# Altium project forwardConverterPCB.PrjPcb (part 10 of 22)
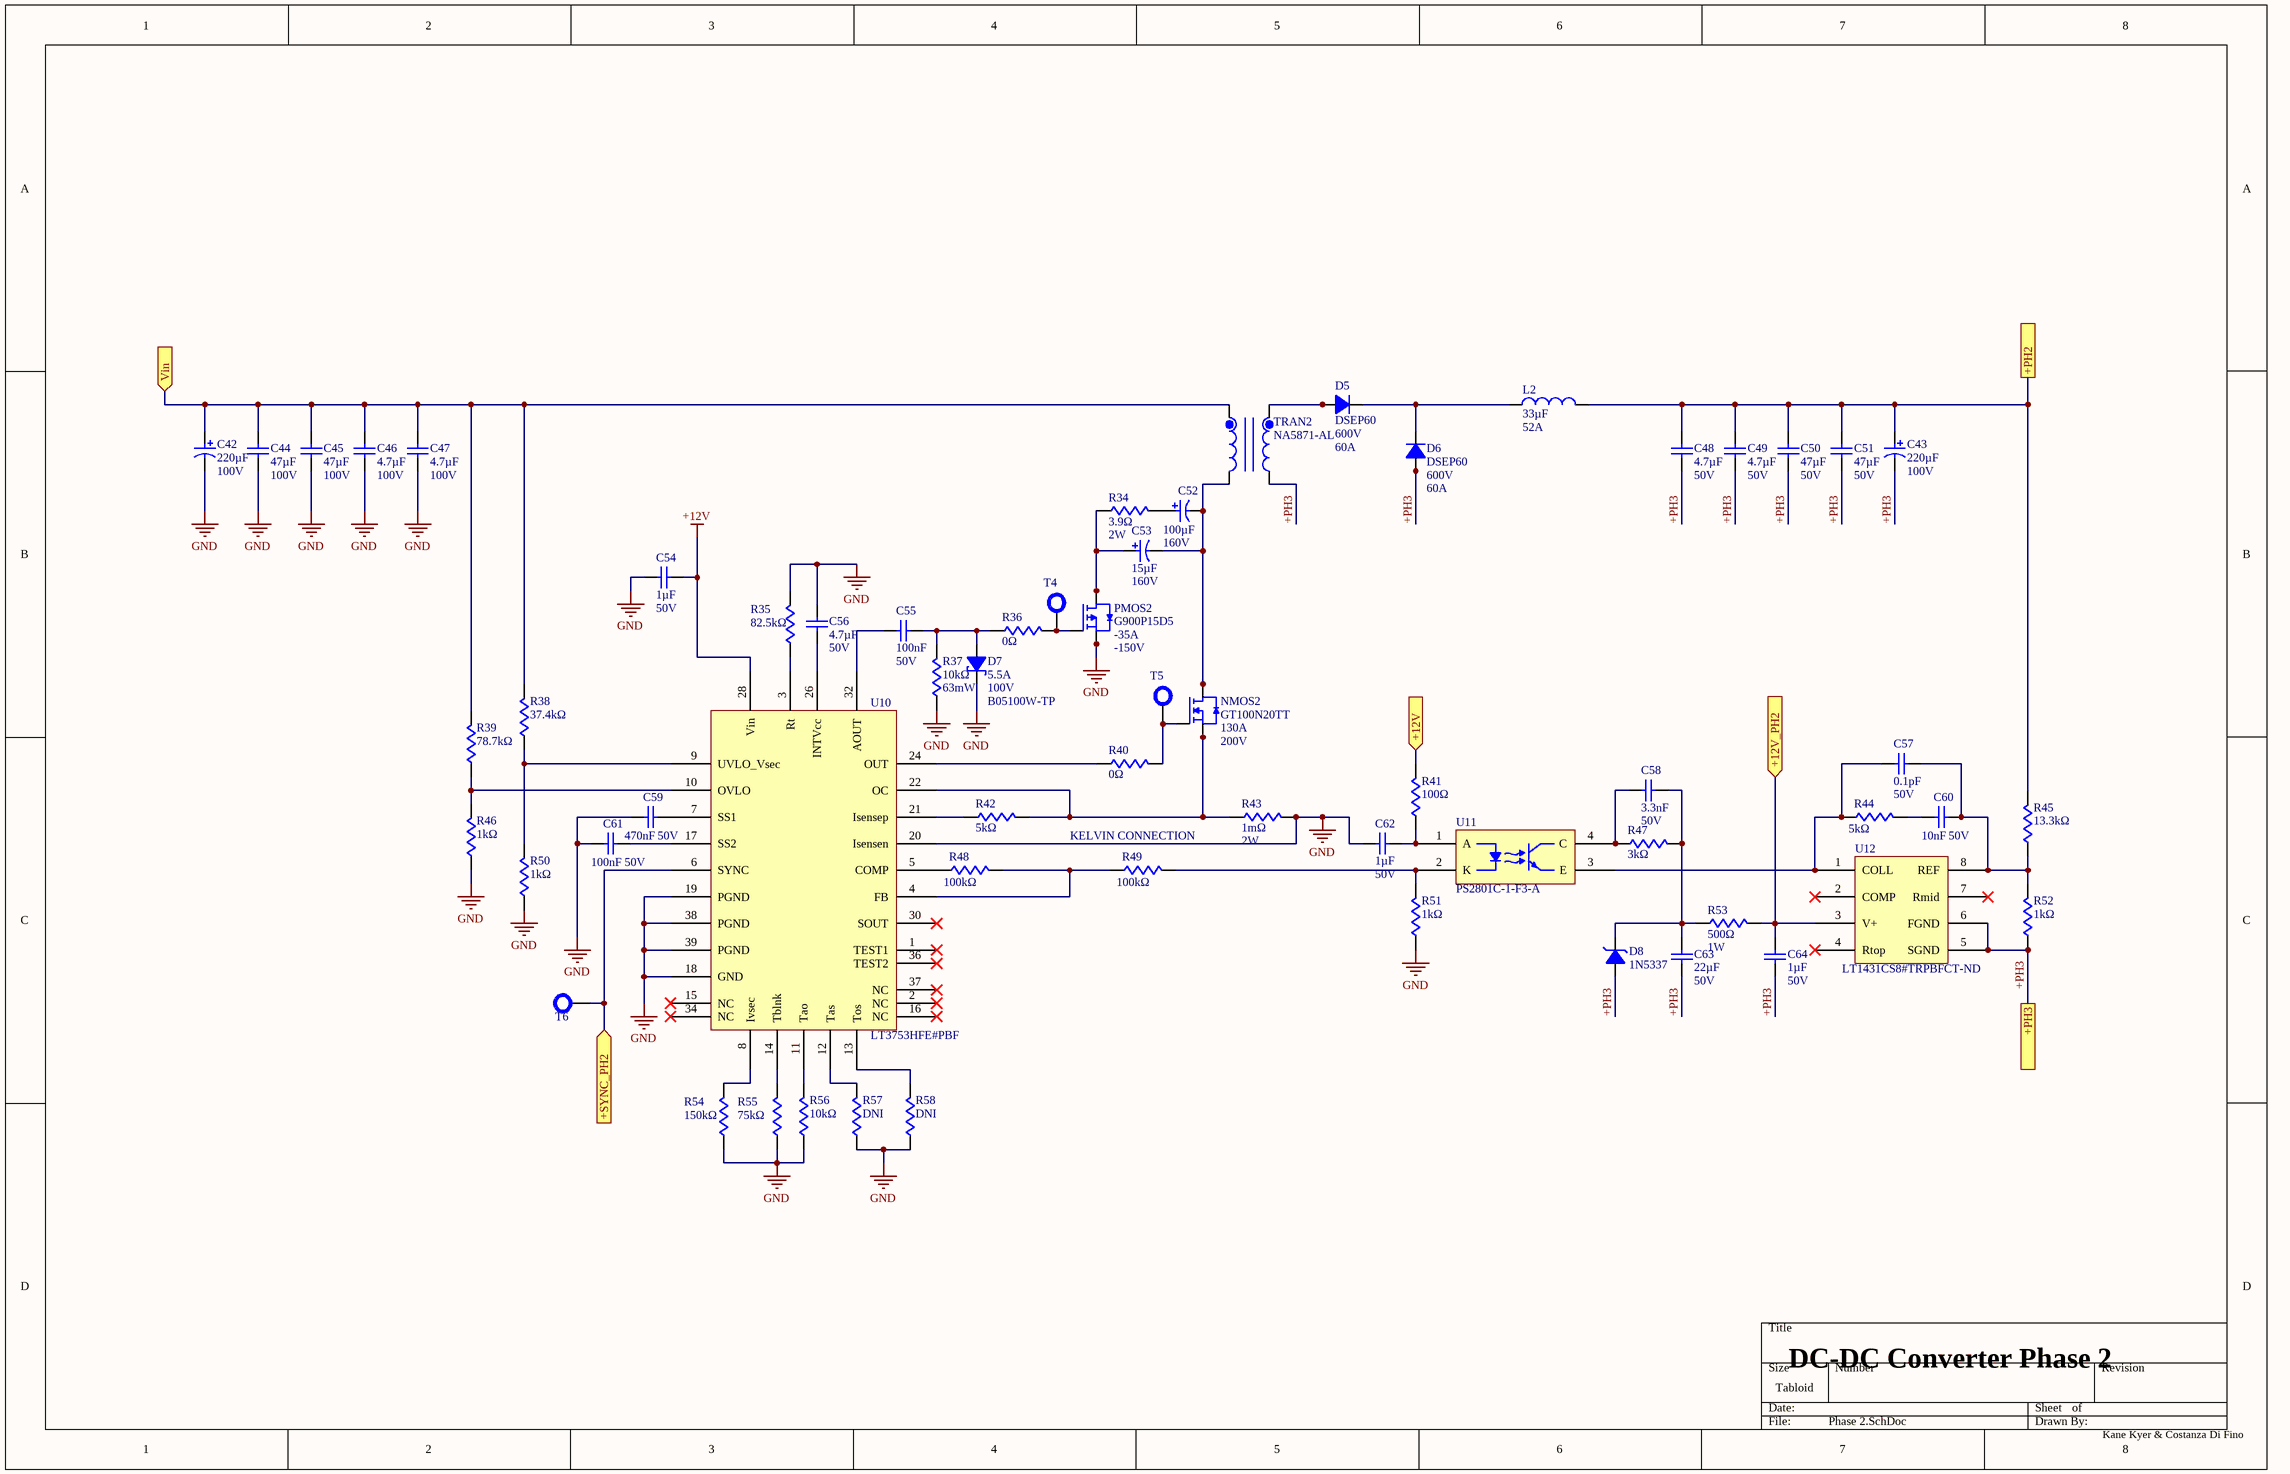
[diagram p15: Phase 2.SchDoc]

## Sheet Phase 2.SchDoc (continued)

### Library data of the parts (continued)
U11 = PS2801C-1-F3-A: Optocoupler DC-IN 1-CH Transistor DC-OUT 4-Pin SSOP T/R; Manufacturer: Renesas; Manufacturer Lifecycle Status: ACTIVE; Collector Emitter Breakdown Voltage: 80V; Collector Emitter Saturation Voltage: 300mV; Current Transfer Ratio: 50%; Dark Current: 100nA; Forward Current: 30mA; Forward Voltage: 1.4V; Input Current: 5mA; Isolation Voltage: 2.5kV; Max Power Dissipation: 120mW; Number of Elements: 1; Reverse Breakdown Voltage: 6V; Target Application: PLC\, Hybrid IC\, Power supply\, OA\, Measuring instrument\, Modem\, Communication devices; Supplier: DigiKey; RoHS: Compliant; Category: Optocouplers; Stock: 8089; Pricing: 1=0.85, 10=0.594, 100=0.436, 500=0.3653, 1000=0.34213 (USD); Case/Package: SSOP; China RoHS: Compliant; Collector Emitter Voltage (VCEO): 80V; Contact Plating: Tin Bismuth; Export Control Classification Number (ECCN) Code: EAR99; Part Family: PS2801C-1; Height: 2.1mm; Harmonized Tariff Schedule (HTS) Code: 8541.49.8000; Lifecycle Status: Production; Max Operating Temperature: 100°C; Min Operating Temperature: -55°C; MSL: 1; Mounting Technology: Surface Mount; Pins: 4; Output Voltage: 80V; Packaging: Cut Tape; REACH SVHC: Yes; ComponentLink1URL: https://datasheet.octopart.com:443/PS2801C-1-F3-A-Renesas-datasheet-179197394.pdf?src-supplier=Integrated+Device+Technology; ComponentLink1Description: https://datasheet.octopart.com:443/PS2801C-1-F3-A-Renesas-datasheet-179197394.pdf?src-supplier=Integrated+Device+Technology; ComponentLink2URL: https://datasheet.octopart.com:443/PS2801C-1-F3-A-Renesas-datasheet-150850810.pdf?src-supplier=Integrated+Device+Technology; ComponentLink2Description: https://datasheet.octopart.com:443/PS2801C-1-F3-A-Renesas-datasheet-150850810.pdf?src-supplier=Integrated+Device+Technology; ComponentLink3URL: https://datasheet.octopart.com:443/PS2801C-1-F3-A-Integrated-Device-Technology-datasheet-149188203.pdf?src-supplier=Integrated+Device+Technology; ComponentLink3Description: https://datasheet.octopart.com:443/PS2801C-1-F3-A-Integrated-Device-Technology-datasheet-149188203.pdf?src-supplier=Integrated+Device+Technology; ComponentLink4URL: https://datasheet.octopart.com:443/PS2801C-1-F3-A-Renesas-datasheet-181196928.pdf?src-supplier=IHS; ComponentLink4Description: https://datasheet.octopart.com:443/PS2801C-1-F3-A-Renesas-datasheet-181196928.pdf?src-supplier=IHS; ComponentLink5URL: https://datasheet.octopart.com:443/PS2801C-1-F3-A-NEC-datasheet-180895691.pdf?src-supplier=IHS; ComponentLink5Description: https://datasheet.octopart.com:443/PS2801C-1-F3-A-NEC-datasheet-180895691.pdf?src-supplier=IHS; ComponentLink6URL: https://datasheet.octopart.com:443/PS2801C-1-F3-A-Renesas-datasheet-138175760.pdf?src-supplier=Renesas; ComponentLink6Description: https://datasheet.octopart.com:443/PS2801C-1-F3-A-Renesas-datasheet-138175760.pdf?src-supplier=Renesas; ComponentLink7URL: https://datasheet.octopart.com:443/PS2801C-1-F3-A-Renesas-datasheet-5346041.pdf?src-supplier=element14+APAC; ComponentLink7Description: https://datasheet.octopart.com:443/PS2801C-1-F3-A-Renesas-datasheet-5346041.pdf?src-supplier=element14+APAC; ComponentLink8URL: https://datasheet.octopart.com:443/PS2801C-1-F3-A-Renesas-datasheet-136880012.pdf?src-supplier=Future+Electronics; ComponentLink8Description: https://datasheet.octopart.com:443/PS2801C-1-F3-A-Renesas-datasheet-136880012.pdf?src-supplier=Future+Electronics; ComponentLink9URL: http://sigma.octopart.com:80/reach_statement/Renesas-company-45.pdf?src-supplier=Compliance+Statements; ComponentLink9Description: http://sigma.octopart.com:80/reach_statement/Renesas-company-45.pdf?src-supplier=Compliance+Statements; ComponentLink10URL: http://sigma.octopart.com:80/conflict_mineral_statement/Renesas-company-44.pdf?src-supplier=Compliance+Statements; ComponentLink10Description: http://sigma.octopart.com:80/conflict_mineral_statement/Renesas-company-44.pdf?src-supplier=Compliance+Statements; Supplier Part Number: 559-1038-1-ND; Manufacturer Part Number: PS2801C-1-F3-A
U12 = LT1431CS8#TRPBF: V-Ref Adjustable 2.5V to 36V 100mA 8-Pin SOIC N T/R; Manufacturer: Analog Devices; Manufacturer Lifecycle Status: PRODUCTION; Cathode Current: 1mA; Reference Type: Shunt; Temperature Coefficient: 30ppm/°C; Tolerance: 0.4%; Supplier: DigiKey; Manufacturer Part Number: LT1431CS8#TRPBF; RoHS: Compliant; Category: Voltage References; Stock: 6692; Pricing: 1=4.76, 10=3.623, 25=3.3384, 100=3.025, 250=2.9682 (USD); Lead Free: Lead Free; Lifecycle Status: Production; Max Operating Temperature: 70°C; Max Output Voltage: 36V; Min Operating Temperature: 0°C; Min Output Voltage: 2.5V; Mounting Technology: Surface Mount; Pins: 8; Output Current: 100mA; Output Type: Adjustable; ComponentLink1URL: https://octopart.com:443/opatz8j6/c1?t=niELlFxzDfi0yCwovPYUCPkFv5h4fu5j3fc6Y_JWgZS-KG3gguwV1nhos1IG-X0q8FOT95_5suT6z4bIqEEHZa5Cr0Tl4wX-4Gea3le2l_P5Btni36aNB0VKN1eACfVw6XjlixpjNPZ2EoCnIZsmdjVtLb4T5dOKJqdmaG9p1s8rLUbRPnop80aw4yYD8dobzP2rtKjoPZxkMFX7s_x1MbrDISVlTufhy0OqU5fodmlGcRlmdB2uK6Q8wi9wAMnylkp3u30aJUXp9y1pTV4VT8brQ8AQsJucKiRghXvlz7QI_mNVRP68og&src-supplier=Analog+Devices; ComponentLink1Description: https://octopart.com:443/opatz8j6/c1?t=niELlFxzDfi0yCwovPYUCPkFv5h4fu5j3fc6Y_JWgZS-KG3gguwV1nhos1IG-X0q8FOT95_5suT6z4bIqEEHZa5Cr0Tl4wX-4Gea3le2l_P5Btni36aNB0VKN1eACfVw6XjlixpjNPZ2EoCnIZsmdjVtLb4T5dOKJqdmaG9p1s8rLUbRPnop80aw4yYD8dobzP2rtKjoPZxkMFX7s_x1MbrDISVlTufhy0OqU5fodmlGcRlmdB2uK6Q8wi9wAMnylkp3u30aJUXp9y1pTV4VT8brQ8AQsJucKiRghXvlz7QI_mNVRP68og&src-supplier=Analog+Devices; ComponentLink2URL: https://datasheet.octopart.com:443/LT1431CS8%23TRPBF-Analog-Devices-datasheet-158590489.pdf?src-supplier=Augswan; ComponentLink2Description: https://datasheet.octopart.com:443/LT1431CS8%23TRPBF-Analog-Devices-datasheet-158590489.pdf?src-supplier=Augswan; ComponentLink3URL: https://sigma.octopart.com:443/57689574/technical_drawing/Linear-Technology-LT1431CS8%23TRPBF.pdf?src-supplier=Linear+Technology; ComponentLink3Description: https://sigma.octopart.com:443/57689574/technical_drawing/Linear-Technology-LT1431CS8%23TRPBF.pdf?src-supplier=Linear+Technology; ComponentLink4URL: https://datasheet.octopart.com:443/LT1431CS8%23TRPBF-Linear-Technology-datasheet-12663249.pdf?src-supplier=Linear+Technology; ComponentLink4Description: https://datasheet.octopart.com:443/LT1431CS8%23TRPBF-Linear-Technology-datasheet-12663249.pdf?src-supplier=Linear+Technology; ComponentLink5URL: https://datasheet.octopart.com:443/LT1431CS8%23TRPBF-Linear-Technology-datasheet-14162000.pdf?src-supplier=iiiC; ComponentLink5Description: https://datasheet.octopart.com:443/LT1431CS8%23TRPBF-Linear-Technology-datasheet-14162000.pdf?src-supplier=iiiC; ComponentLink6URL: https://datasheet.octopart.com:443/LT1431CS8%23TRPBF-Linear-Technology-datasheet-660441.pdf?src-supplier=Component+Distributors+Inc.; ComponentLink6Description: https://datasheet.octopart.com:443/LT1431CS8%23TRPBF-Linear-Technology-datasheet-660441.pdf?src-supplier=Component+Distributors+Inc.; ComponentLink7URL: http://sigma.octopart.com:80/conflict_mineral_statement/Analog-Devices-company-33.pdf?src-supplier=Compliance+Statements; ComponentLink7Description: http://sigma.octopart.com:80/conflict_mineral_statement/Analog-Devices-company-33.pdf?src-supplier=Compliance+Statements; ComponentLink8URL: https://octopart.com:443/opatz8j6/c1?t=x_UgC8z0ZW9HVBYfWtRK1MQXyidqPpcSjAfueHo9YnawvAkFl5SvDyGxYSqo2jvWZKzVJDVTRvwyt6-9bSOmk9hm3rvBRrSJoViBsOBz-zaTqDQ1UuTon1oynDbAG1BJ8LFFGJ-pvHqqe_ahwIPaiUAyxwKDpl_WDXhLfkPwU4s3DC4oM42DqSA56VDCGnGZU0YdFavN5d4mf8bZyX9JjAzy5--p3JbOg0D6jqXi6c2GCo47z_BbYPuyEPlhjEKZPTviFMXkQtwuopNuNXSm1BD9XLOQFCoZDF8jjiZ5eNS4L1NzzTsuyw&src-supplier=Compliance+Statements; ComponentLink8Description: https://octopart.com:443/opatz8j6/c1?t=x_UgC8z0ZW9HVBYfWtRK1MQXyidqPpcSjAfueHo9YnawvAkFl5SvDyGxYSqo2jvWZKzVJDVTRvwyt6-9bSOmk9hm3rvBRrSJoViBsOBz-zaTqDQ1UuTon1oynDbAG1BJ8LFFGJ-pvHqqe_ahwIPaiUAyxwKDpl_WDXhLfkPwU4s3DC4oM42DqSA56VDCGnGZU0YdFavN5d4mf8bZyX9JjAzy5--p3JbOg0D6jqXi6c2GCo47z_BbYPuyEPlhjEKZPTviFMXkQtwuopNuNXSm1BD9XLOQFCoZDF8jjiZ5eNS4L1NzzTsuyw&src-supplier=Compliance+Statements

## Sheet Phase 3.SchDoc
size Tabloid; SheetNumber: 5; SheetTotal: 7
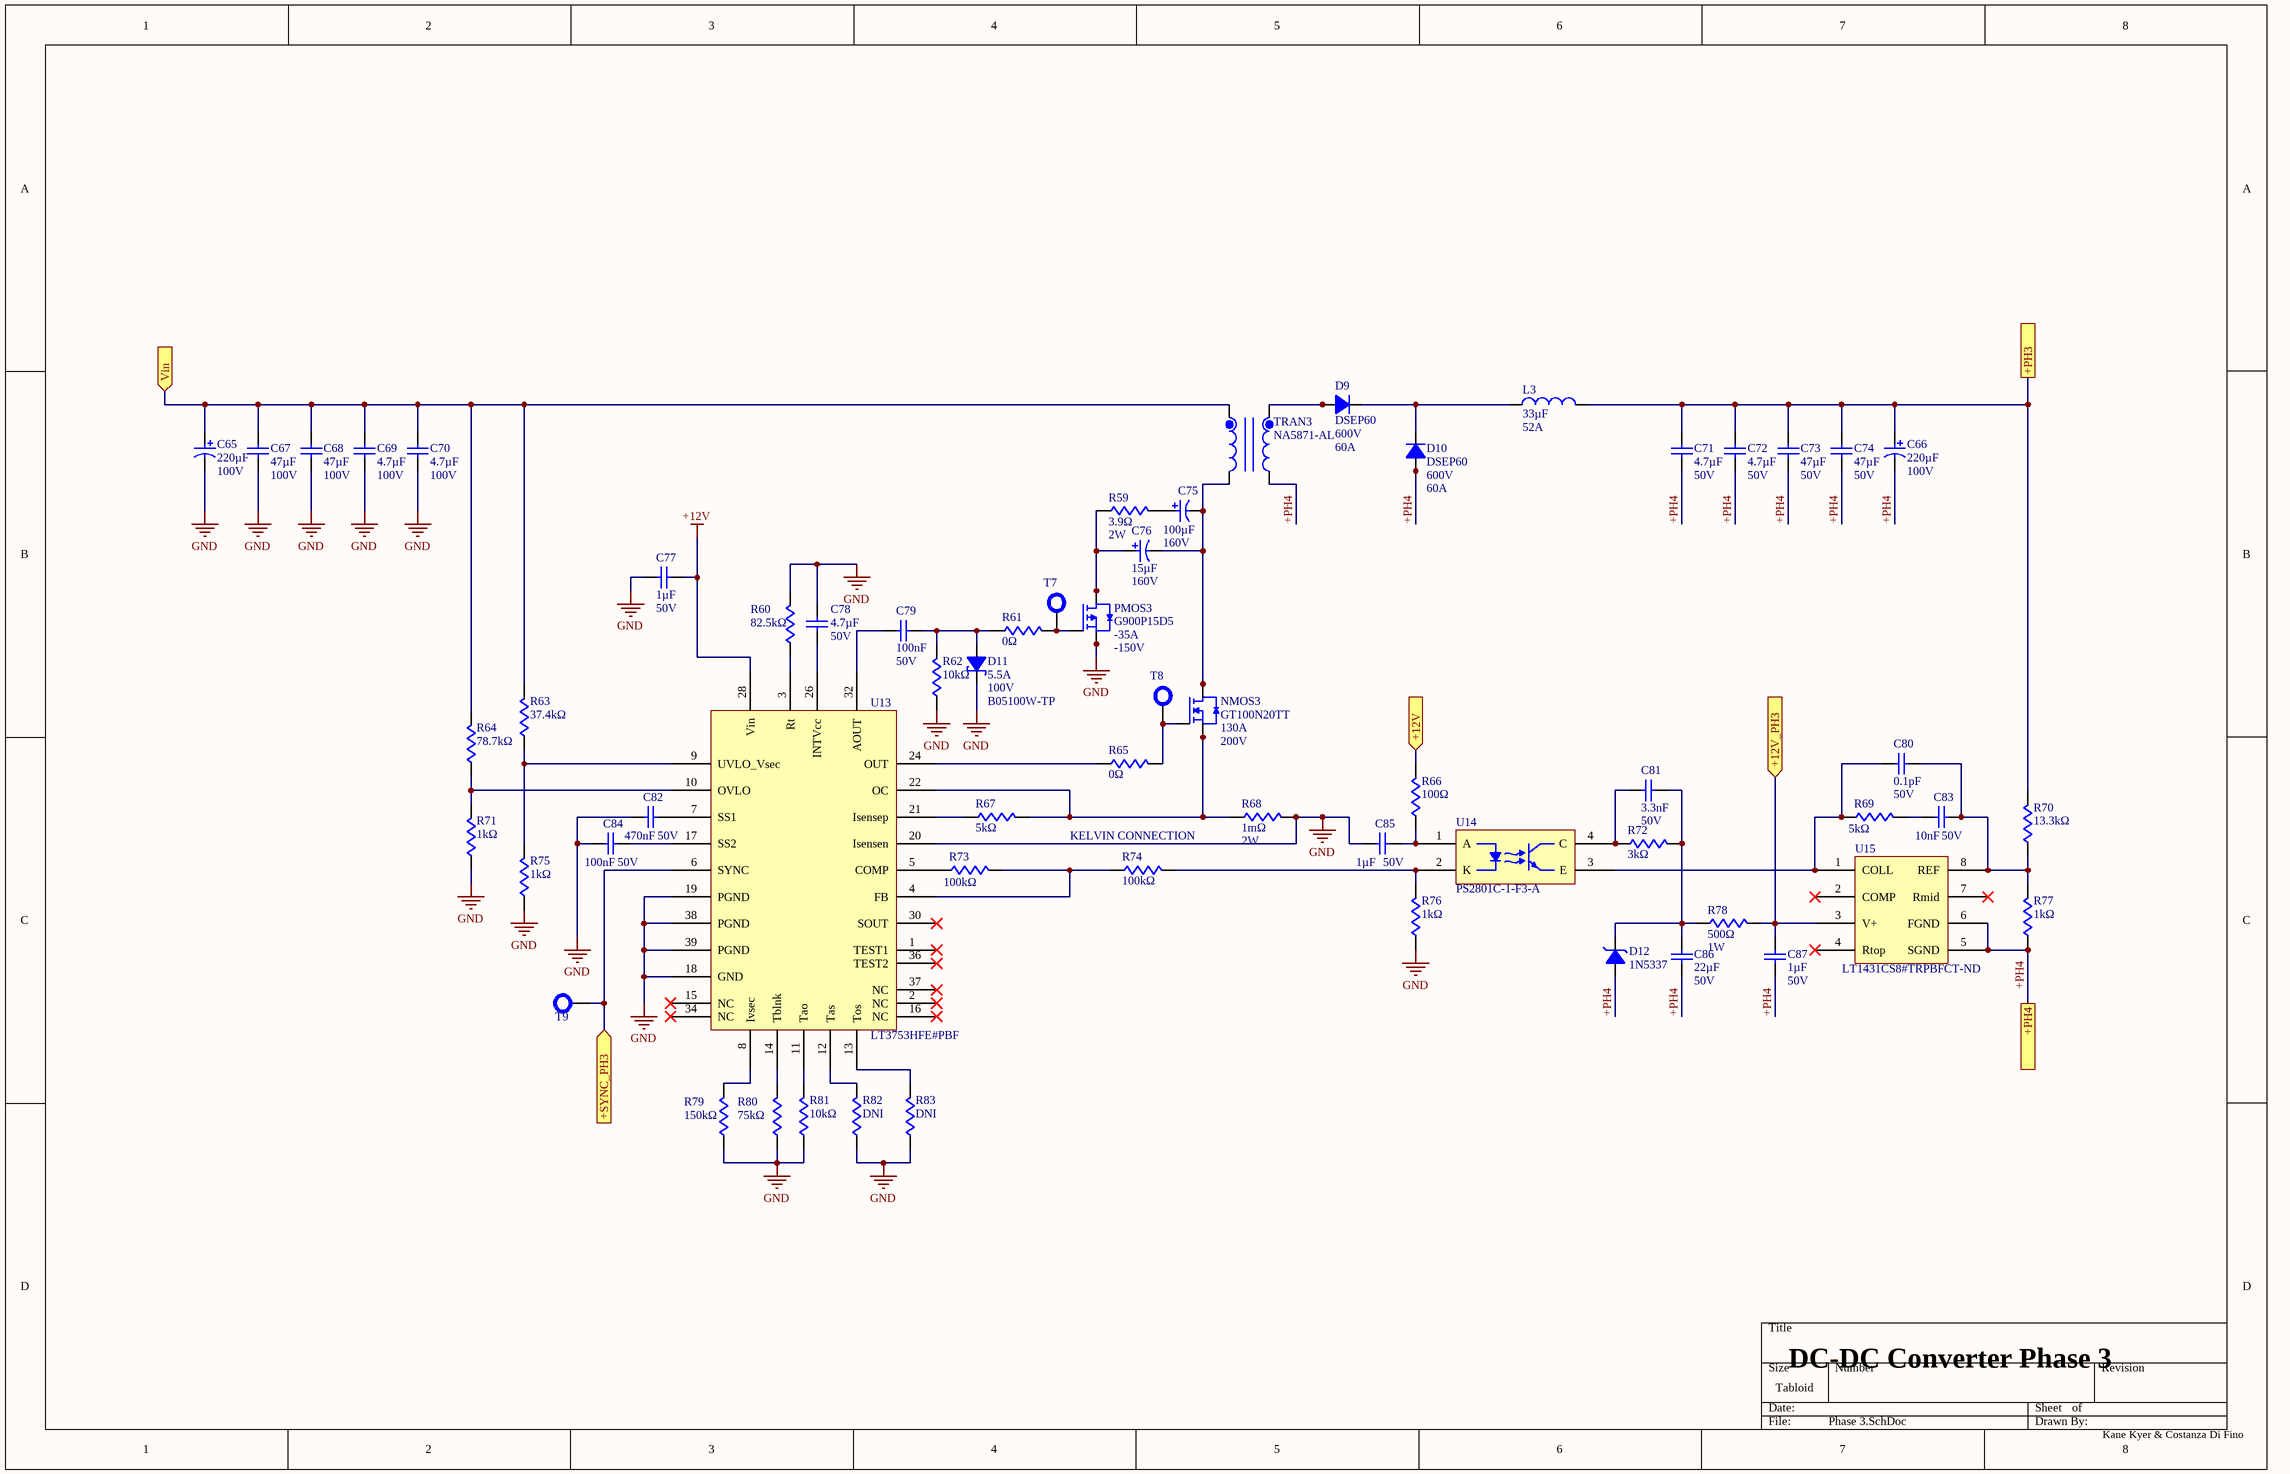
[diagram p4: Phase 3.SchDoc]

### Parts
C65  value 220µF  Voltage Rating: 100V  [C_AEC]  (hidden comment: AFK227M2AR44T-F)
C66  value 220µF  Voltage Rating: 100V  [C_AEC]  (hidden comment: AFK227M2AR44T-F)
C67  value 47µF  Voltage Rating: 100V  [C_CAA573]  (hidden comment: CAA573X7S2A476M640LH)
C68  value 47µF  Voltage Rating: 100V  [C_CAA573]  (hidden comment: CAA573X7S2A476M640LH)
C69  value 4.7µF  Voltage Rating (DC): 100V  [C_1210]  (hidden comment: GMC32X7S475K100NT)
C70  value 4.7µF  Voltage Rating (DC): 100V  [C_1210]  (hidden comment: GMC32X7S475K100NT)
C71  value 4.7µF  Voltage Rating (DC): 50V  [C_1206]  (hidden comment: GMC31X7R475K50NT)
C72  value 4.7µF  Voltage Rating (DC): 50V  [C_1206]  (hidden comment: GMC31X7R475K50NT)
C73  value 47µF  Voltage Rating (DC): 50V  [C_CKG57N]  (hidden comment: CKG57NX7R1H476M500JJ)
C74  value 47µF  Voltage Rating (DC): 50V  [C_CKG57N]  (hidden comment: CKG57NX7R1H476M500JJ)
C75  value 100µF  Voltage Rating (DC): 160V  [UUJ2C101MNJ1MS]  (hidden comment: UUJ2C101MNJ1MS)
C76  value 15µF  Voltage: 160V  [ULT2C150MNL1GS]  (hidden comment: ULT2C150MNL1GS)
C77  value 1µF  Voltage: 50V  [C_0805]  (hidden comment: CL21B105KBFNNNE)
C78  value 4.7µF  Voltage Rating (DC): 50V  [C_1206]  (hidden comment: GMC31X7R475K50NT)
C79  value 100nF  Voltage Rating: 50V  [C_0603]  (hidden comment: C0603C104K5RACTU)
C80  value 0.1pF  Voltage Rating: 50V  [C_0402]  (hidden comment: GJM1555C1HR10WB01D)
C81  value 3.3nF  Voltage Rating: 50V  [C_0603]  (hidden comment: GCM1885C1H332FA16D)
C82  value 470nF  Voltage Rating: 50V  [C_0402]  (hidden comment: GRM155R61H474KE11D)
C83  value 10nF  Voltage Rating: 50V  [C_0603]  (hidden comment: C0603C103K5RACTU)
C84  value 100nF  Voltage Rating: 50V  [C_0603]  (hidden comment: C0603C104K5RACTU)
C85  value 1µF  Voltage: 50V  [C_0805]  (hidden comment: CL21B105KBFNNNE)
C86  value 22µF  Voltage Rating (DC): 50V  [C_2220]  (hidden comment: GMC55X7R226M50NT)
C87  value 1µF  Voltage: 50V  [C_0805]  (hidden comment: CL21B105KBFNNNE)
D9  DSEP60  Vr: 600V  Io: 60A  [D_DSEP60]
D10  DSEP60  Vr: 600V  Io: 60A  [D_DSEP60]
D11  Max Forward Surge Current (Ifsm): 5.5A  Min Breakdown Voltage: 100V  [D_B05100W]  (hidden comment: B05100W-TP)
D12  Supplier Part Number: 1N5337  [D_1N5337]  (hidden comment: 1N5337BRLG)
L3  value 33µF  Irms: 52A  [CPEX4141L-330MC]  (hidden comment: CPEX4141L-330MC)
NMOS3  Id: 130A  Vds: 200V  [GT100N20TT]  (hidden comment: GT100N20TT)
PMOS3  Id: -35A  Vds: -150V  [G900P15]  (hidden comment: G900P15D5)
R59  value 3.9Ω  Power Rating: 2W  [R_SM2W]  (hidden comment: SMW23R9JT)
R60  value 82.5kΩ  [R_0805]  (hidden comment: RMCF0805FT82K5)
R61  value 0Ω  [R_0805]  (hidden comment: CRCW08050000Z0EA)
R62  value 10kΩ  [R_0402]  (hidden comment: RM04F1002CT)
R63  value 37.4kΩ  [R_0603]  (hidden comment: RC0603FR-0737K4L)
R64  value 78.7kΩ  [R_0603]  (hidden comment: RC0603FR-0778K7L)
R65  value 0Ω  [R_0805]  (hidden comment: CRCW08050000Z0EA)
R66  value 100Ω  [R_0603]  (hidden comment: RC0603FR-07100RL)
R67  value 5kΩ  [R_0402]  (hidden comment: PNM0402E5001BST1)
R68  value 1mΩ  Power Rating: 2W  [R_2512]  (hidden comment: CRE2512-FZ-R001E-2)
R69  value 5kΩ  [R_0402]  (hidden comment: PNM0402E5001BST1)
R70  value 13.3kΩ  [R_0603]  (hidden comment: RMCF0603FT13K3)
R71  value 1kΩ  [R_0402]  (hidden comment: RM04F1001CT)
R72  value 3kΩ  [C_0402]  (hidden comment: AC0402FR-073KL)
R73  value 100kΩ  [R_0402]  (hidden comment: RM04F1003CT)
R74  value 100kΩ  [R_0402]  (hidden comment: RM04F1003CT)
R75  value 1kΩ  [R_0402]  (hidden comment: RM04F1001CT)
R76  value 1kΩ  [R_0402]  (hidden comment: RM04F1001CT)
R77  value 1kΩ  [R_0402]  (hidden comment: RM04F1001CT)
R78  value 500Ω  Power Rating: 1W  [R_WSC2515]  (hidden comment: WSC2515500R0FEB)
R79  value 150kΩ  [R_0603]  (hidden comment: RC0603FR-07150KL)
R80  value 75kΩ  [R_0603]  (hidden comment: AC0603FR-0775KL)
R81  value 10kΩ  [R_0402]  (hidden comment: RM04F1002CT)
R82  value DNI  [R_0805]  (hidden comment: CRCW08050000Z0EA)
R83  value DNI  [R_0805]  (hidden comment: CRCW08050000Z0EA)
T7  TEST  [TEST_POINT]  (value not drawn)
T8  TEST  [TEST_POINT]  (value not drawn)
T9  TEST  [TEST_POINT]  (value not drawn)
TRAN3  NA5871-AL  [NA5871-AL]
U13  LT3753HFE#PBF  [LT3753]
U14  PS2801C-1-F3-A  [PS2801C]
U15  Supplier Part Number: LT1431CS8#TRPBFCT-ND  [LT1431]  (hidden comment: LT1431CS8#TRPBF)

### Ports
+12V (in, see SHEET_MAP[4C], Externals[2A], Phase 1[4C], Phase 2[4C], Phase 4[4C], Phase 5[4B]), +12V_PH3 (in, see SHEET_MAP[4C], Externals[6B]), +PH3 (see SHEET_MAP[4B], Externals[4C], Phase 2[6C]), +PH4 (see SHEET_MAP[4C], Externals[6B], Phase 4[6B]), +SYNC_PH3 (in, see SHEET_MAP[4C], Externals[3C]), Vin (in, see SHEET_MAP[4B], Externals[1A], Phase 1[1B], Phase 2[1B], Phase 4[1B], Phase 5[1B])

### Nets
+12V: C77.2 R66.2 U13.28(Vin) ; port +12V
GND: C65.2 C67.1 C68.1 C69.1 C70.1 C77.1 C78.1 C82.1 C84.1 C85.1 D11.1 PMOS3.1(S) PMOS3.2(S) PMOS3.3(S) R60.2 R62.1 R68.2 R71.1 R75.1 R76.1 R79.1 R80.1 R81.1 R82.1 R83.1 U13.18(GND) U13.19(PGND) U13.20(Isensen) U13.38(PGND) U13.39(PGND)
Vin: C65.1 C67.2 C68.2 C69.2 C70.2 R63.2 R64.2 TRAN3.1 ; port Vin
+PH3: C66.1 C71.2 C72.2 C73.2 C74.2 L3.2 R70.2 ; port +PH3
+PH4: C66.2 C71.1 C72.1 C73.1 C74.1 C86.1 C87.1 D10.1(A) D10.3(A) D12.2 R77.1 TRAN3.11 U15.5(SGND) U15.6(FGND) ; port +PH4
NetC27_2: C87.2 R78.2 U15.3(V+) ; port +12V_PH3
NetC75_1: C75.1 R59.2
NetC75_2: C75.2 C76.2 NMOS3.9(D) NMOS3.10(D) NMOS3.11(D) NMOS3.12(D) NMOS3.13(D) NMOS3.14(D) NMOS3.15(D) NMOS3.16(D) TRAN3.4
NetC76_1: C76.1 PMOS3.5(D) PMOS3.6(D) PMOS3.7(D) PMOS3.8(D) R59.1
NetC78_2: C78.2 U13.26(INTVcc)
NetC79_1: C79.1 U13.32(AOUT)
NetC79_2: C79.2 D11.2 R61.1 R62.2
NetC80_1: C80.1 R69.1 U14.3(E) U15.1(COLL)
NetC80_2: C80.2 C83.2 R70.1 R77.2 U15.8(REF)
NetC81_1: C81.1 R72.1 U14.4(C)
NetC81_2: C81.2 C86.2 D12.1 R72.2 R78.1
NetC82_2: C82.2 U13.7(SS1)
NetC83_1: C83.1 R69.2
NetC84_2: C84.2 U13.17(SS2)
NetC85_2: C85.2 R66.1 U14.1(A)
NetD9_1: D9.1(A) D9.3(A) TRAN3.6
NetD9_4: D9.4(C) D10.4(C) L3.1
NetNMOS3_1: NMOS3.1(S) NMOS3.2(S) NMOS3.3(S) NMOS3.4(S) NMOS3.5(S) NMOS3.6(S) NMOS3.7(S) R67.2 R68.1 U13.22(OC)
NetNMOS3_8: NMOS3.8(G) R65.2 T8.1
NetPMOS3_4: PMOS3.4(G) R61.2 T7.1
NetR60_1: R60.1 U13.3(Rt)
NetR63_1: R63.1 R75.2 U13.9(UVLO_Vsec)
NetR64_1: R64.1 R71.2 U13.10(OVLO)
NetR65_1: R65.1 U13.24(OUT)
NetR67_1: R67.1 U13.21(Isensep)
NetR73_1: R73.1 U13.5(COMP)
NetR73_2: R73.2 R74.1 U13.4(FB)
NetR74_2: R74.2 R76.2 U14.2(K)
NetR79_2: R79.2 U13.8(Ivsec)
NetR80_2: R80.2 U13.14(Tblnk)
NetR81_2: R81.2 U13.11(Tao)
NetR82_2: R82.2 U13.12(Tas)
NetR83_2: R83.2 U13.13(Tos)
NetT9_1: T9.1 U13.6(SYNC) ; port +SYNC_PH3

Not connected (* = marked no-connect by the designer): U13 1(TEST1)* 2(NC)* 15(NC)* 16(NC)* 30(SOUT)* 34(NC)* 36(TEST2)* 37(NC)*; U15 2(COMP)* 4(Rtop)* 7(Rmid)*

### Notes on the sheet
- (near R74) KELVIN CONNECTION
- DC-DC Converter Phase 3
- Kane Kyer & Costanza Di Fino